# EAGLE design ASD2841 (EAGLE 6.3)
DATABASE: ./../../../../../Components/TinyCircuits_Part_Database.txt
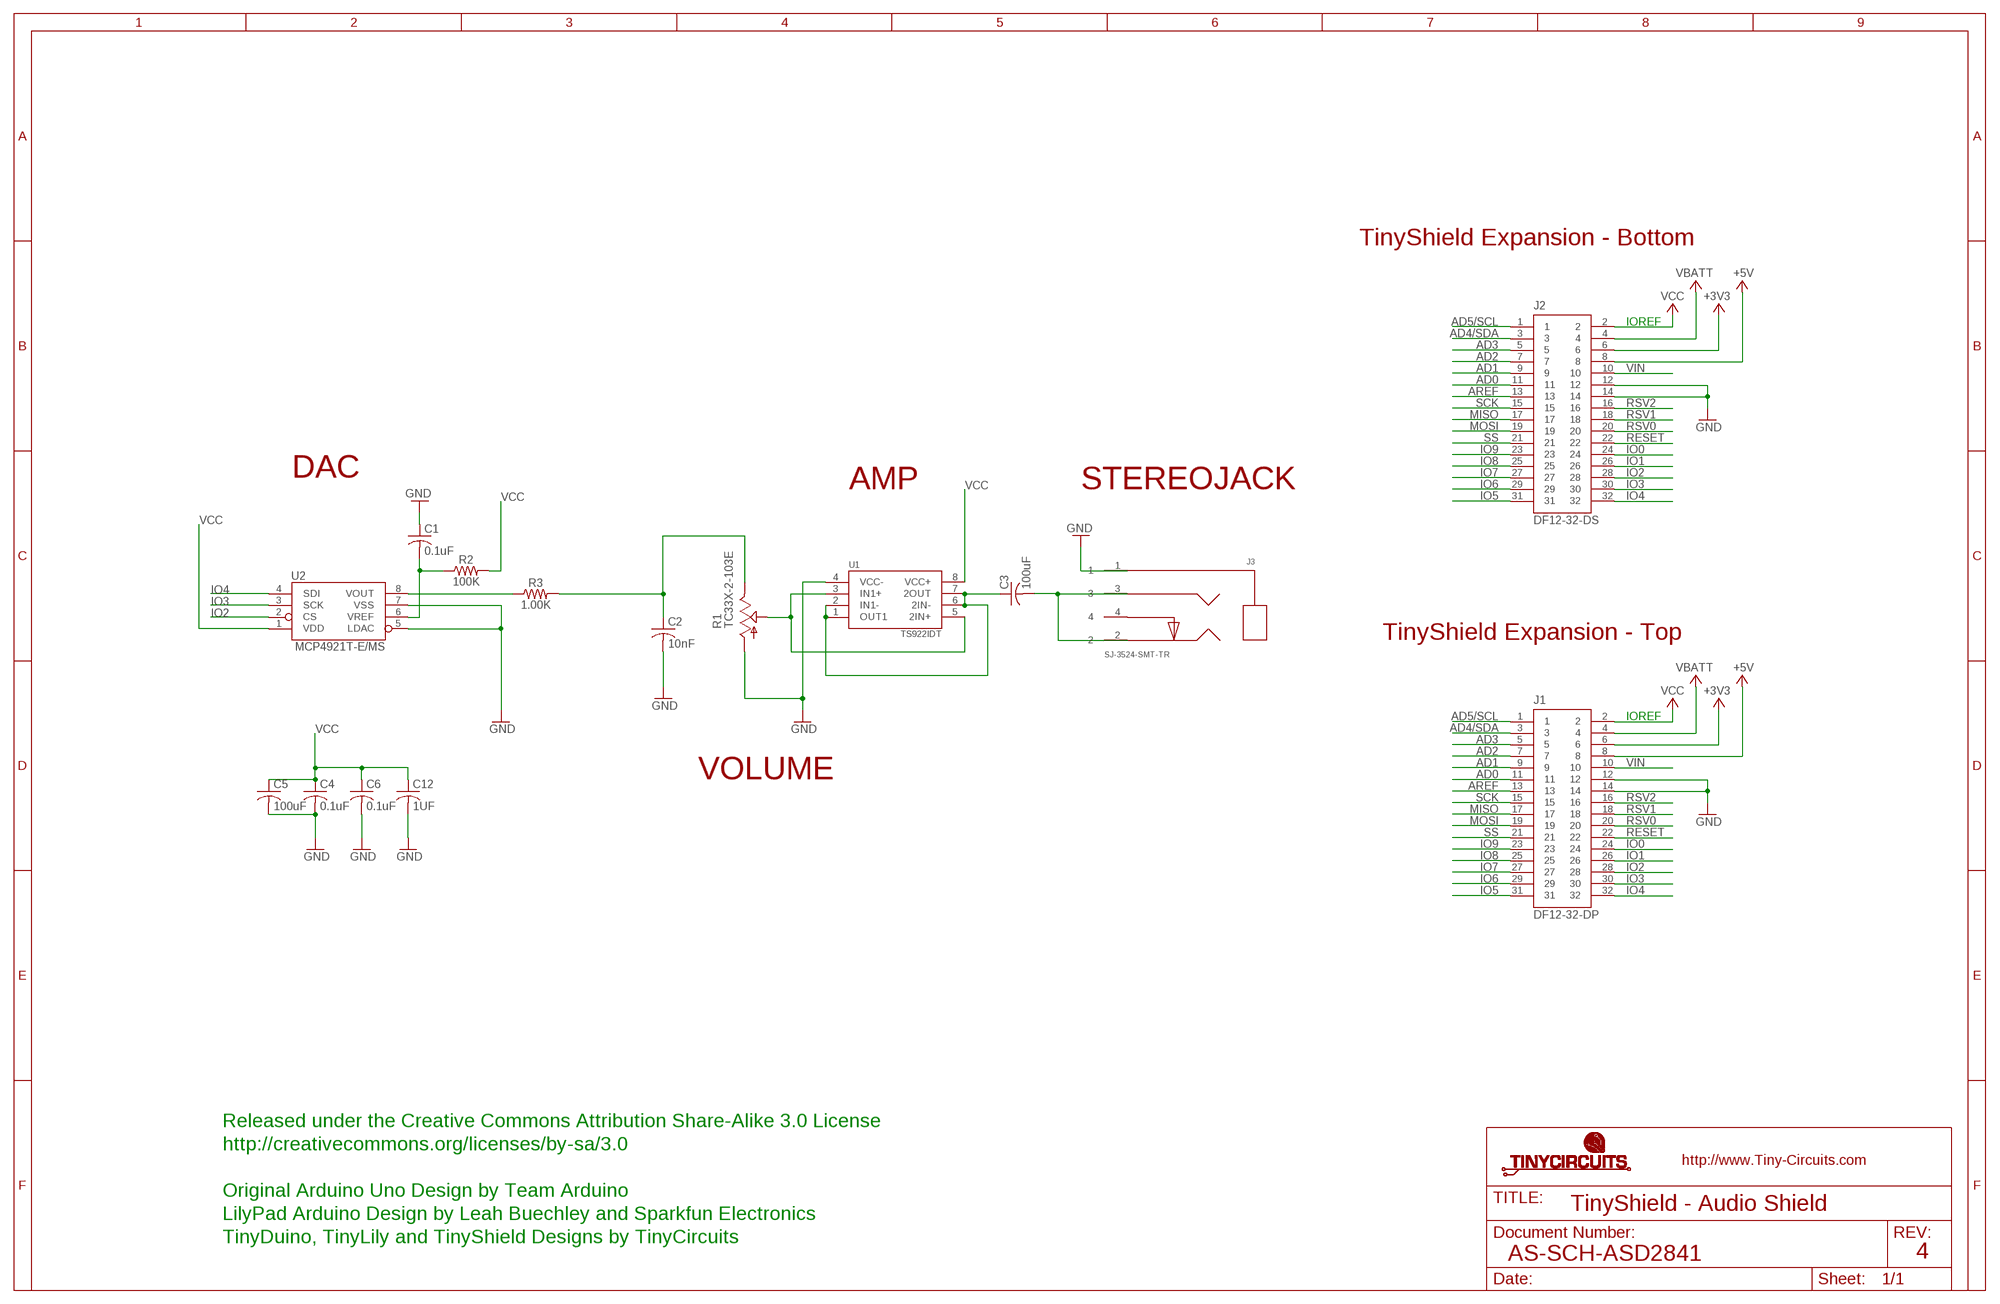
[diagram p0: schematic, sheet 1]

## Parts
C1  0.1uF  AS-ITM-00008  [C0402]
C2  10nF  AS-ITM-00084  [C0402]
C3  100uF  AS-ITM-00095  [C1206]
C4  0.1uF  AS-ITM-00008  [C0402]
C5  100uF  AS-ITM-00095  [C1206]
C6  0.1uF  AS-ITM-00008  [C0402]
C12  1UF  AS-ITM-00105  [C0402]
J1  DF12-32-DP  AS-ITM-00015  [DF12-32-DP]
J2  DF12-32-DS  AS-ITM-00012  [DF12-32-DS]
J3  SJ-3524-SMT-TR  AS-ITM-00094  [SJ-3524-SMT-TR]
R1  TC33X-2-103E  AS-ITM-00187  [TC33X-2-104E]
R2  100K  AS-ITM-00004  [0402]
R3  1.00K  AS-ITM-00003  [0402]
U1  TS922IDT  AS-ITM-00092  [SO-08]
U2  MCP4921T-E/MS  AS-ITM-00091  [MSOP8]

## Nets
+3V3: J1.6 J2.6
+5V: J1.8 J2.8
AD0: J1.11 J2.11
AD1: J1.9 J2.9
AD2: J1.7 J2.7
AD3: J1.5 J2.5
AD4/SDA: J1.3 J2.3
AD5/SCL: J1.1 J2.1
AREF: J1.13 J2.13
GND: C1.1 C2.2 C4.2 C5.2 C6.2 C12.2 J1.12 J1.14 J2.12 J2.14 J3.1 R1.1(A) U1.4(VCC-) U2.5(LDAC) U2.7(VSS)
IO0: J1.24 J2.24
IO1: J1.26 J2.26
IO2: J1.28 J2.28 U2.2(CS)
IO3: J1.30 J2.30 U2.3(SCK)
IO4: J1.32 J2.32 U2.4(SDI)
IO5: J1.31 J2.31
IO6: J1.29 J2.29
IO7: J1.27 J2.27
IO8: J1.25 J2.25
IO9: J1.23 J2.23
MISO: J1.17 J2.17
MOSI: J1.19 J2.19
N$1: R1.2(S) U1.3(IN1+) U1.5(2IN+)
N$2: C3.1 U1.1(OUT1) U1.2(IN1-) U1.6(2IN-) U1.7(2OUT)
N$3: C1.2 R2.1 U2.6(VREF)
N$4: R3.1 U2.8(VOUT)
N$9: C2.1 R1.3(E) R3.2
N$10: C3.2 J3.2 J3.3
RESET: J1.22 J2.22
RSV0: J1.20 J2.20
RSV1: J1.18 J2.18
RSV2: J1.16 J2.16
SCK: J1.15 J2.15
SS: J1.21 J2.21
VBATT: J1.4 J2.4
VCC: C4.1 C5.1 C6.1 C12.1 J1.2 J2.2 R2.2 U1.8(VCC+) U2.1(VDD)
VIN: J1.10 J2.10
Unconnected: J3.4

## Notes on the sheet
- TinyShield Expansion - Bottom
- IOREF
- DAC
- AMP | STEREOJACK
- TinyShield Expansion - Top
- IOREF
- VOLUME
- Released under the Creative Commons Attribution Share-Alike 3.0 License
- http://creativecommons.org/licenses/by-sa/3.0
- Original Arduino Uno Design by Team Arduino
- TinyShield - Audio Shield
- LilyPad Arduino Design by Leah Buechley and Sparkfun Electronics
- TinyDuino, TinyLily and TinyShield Designs by TinyCircuits
- AS-SCH-ASD2841 | 4

## Library data of the parts
C1 C4 C6 = tinycircuits:AS-ITM-00008: CAP CER 0.1UF 16V 10% X5R 0402; PARTNO: AS-ITM-00008
C2 = tinycircuits:AS-ITM-00084: CAP CER 10NF 25V 10% X7R 0402; PARTNO: AS-ITM-00084
C3 C5 = tinycircuits:AS-ITM-00095: CAP CER 100UF 10V 20% X5R 1206; PARTNO: AS-ITM-00095
C12 = tinycircuits:AS-ITM-00105: CAP CER 1UF 6.3V 10% X5R 0402; PARTNO: AS-ITM-00105; VALUE: 1uF
J1 = tinycircuits:AS-ITM-00015: CONN HEADER 32POS 3MM SMD 0.5MM; PARTNO: AS-ITM-00015
J2 = tinycircuits:AS-ITM-00012: CONN RECEPT 32POS 3MM SMD 0.5MM; PARTNO: AS-ITM-00012
J3 = tinycircuits:AS-ITM-00094: CONN AUDIO JACK 3.5MM STEREO SMD; PARTNO: AS-ITM-00094
R1 = tinycircuits:AS-ITM-00187: TRIMMER 10K OHM 0.1W SMD; PARTNO: AS-ITM-00187
R2 = tinycircuits:AS-ITM-00004: RES 100K OHM 1/16W 1% 0402; PARTNO: AS-ITM-00004
R3 = tinycircuits:AS-ITM-00003: RES 1.00K OHM 1/16W 1% 0402; PARTNO: AS-ITM-00003
U1 = tinycircuits:AS-ITM-00092: IC OPAMP GP 4MHZ RRO 8SO; PARTNO: AS-ITM-00092
U2 = tinycircuits:AS-ITM-00091: DAC 12BIT SGL W/SPI 8MSOP; PARTNO: AS-ITM-00091; VALUE: MCP4921-E/MS

## Board
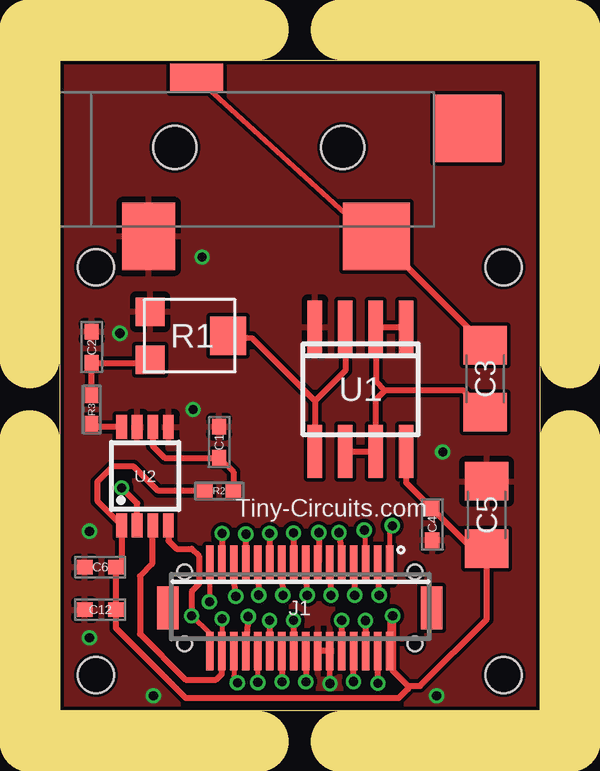
[diagram p1: board, top side]
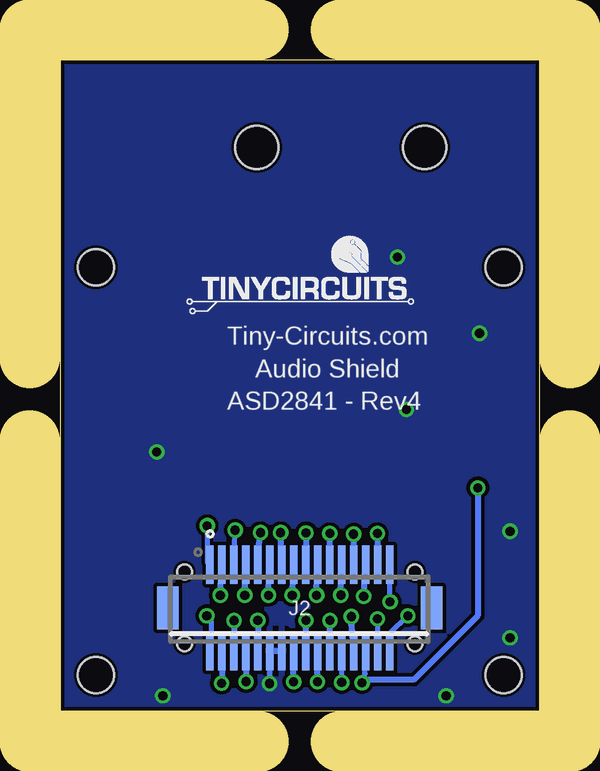
[diagram p2: board, bottom side, seen from below]

Size 20 x 27.14 mm. Coordinates in mm from the lower left corner, seen from the top.
Outline: 0,27.14 20,27.14 20,0 0,0 0,27.14
Copper layers (1*16): Top 0.035mm / dielectric 1.5mm / Bottom 0.035mm
Design rules "default *": minimum track width 8mil, minimum drill 15mil, track to track 6mil, track to pad 6mil, pad to pad 6mil, via to via 6mil, smd to smd 6mil, copper to edge 6mil, drill to drill 8mil, minimum pad ring 10mil, minimum via ring 5mil, stop-mask expansion 4mil, vias tented up to drill 25mil, thermal gap 10mil
Holes 1.5 mm at 1.5,18.5 18.5,18.5 18.5,1.5 1.5,1.5
Milling: 8 lines

### Footprints (pad centres in the part's own frame; a part is rotated, then mirrored left to right if it is on the bottom)
C0402 = smd 0.65 x 0.6: 1 -0.65,0; 2 0.65,0
C1206 = smd 1.6 x 1.8: 1 -1.4,0; 2 1.4,0
DF12-32-DP = smd 0.3 x 1.6: 1 -3.75,-1.8; 2 -3.75,1.8; 3 -3.25,-1.8; 4 -3.25,1.8; 5 -2.75,-1.8; 6 -2.75,1.8; 7 -2.25,-1.8; 8 -2.25,1.8; 9 -1.75,-1.8; 10 -1.75,1.8; 11 -1.25,-1.8; 12 -1.25,1.8; 13 -0.75,-1.8; 14 -0.75,1.8; 15 -0.25,-1.8; 16 -0.25,1.8; 17 0.25,-1.8; 18 0.25,1.8; 19 0.75,-1.8; 20 0.75,1.8; 21 1.25,-1.8; 22 1.25,1.8; 23 1.75,-1.8; 24 1.75,1.8; 25 2.25,-1.8; 26 2.25,1.8; 27 2.75,-1.8; 28 2.75,1.8; 29 3.25,-1.8; 30 3.25,1.8; 31 3.75,-1.8; 32 3.75,1.8 | smd 0.9 x 1.8: F1 -5.5,0; F2 5.5,0 | hole 0.6: -4.8,1.5; 4.8,1.5
DF12-32-DS = smd 0.3 x 1.6: 1 -3.75,1.8; 2 -3.75,-1.8; 3 -3.25,1.8; 4 -3.25,-1.8; 5 -2.75,1.8; 6 -2.75,-1.8; 7 -2.25,1.8; 8 -2.25,-1.8; 9 -1.75,1.8; 10 -1.75,-1.8; 11 -1.25,1.8; 12 -1.25,-1.8; 13 -0.75,1.8; 14 -0.75,-1.8; 15 -0.25,1.8; 16 -0.25,-1.8; 17 0.25,1.8; 18 0.25,-1.8; 19 0.75,1.8; 20 0.75,-1.8; 21 1.25,1.8; 22 1.25,-1.8; 23 1.75,1.8; 24 1.75,-1.8; 25 2.25,1.8; 26 2.25,-1.8; 27 2.75,1.8; 28 2.75,-1.8; 29 3.25,1.8; 30 3.25,-1.8; 31 3.75,1.8; 32 3.75,-1.8 | smd 0.9 x 1.8: F1 -5.5,0; F2 5.5,0 | hole 0.6: -4.8,1.5; 4.8,1.5
SJ-3524-SMT-TR = smd 2.2 x 2.8: 1 -4.1,-3.7 | smd 2.8 x 2.8: 2 5.4,-3.7; 4 9.2,0.8 | smd 2.2 x 1.2: 3 -2.1,2.9 | hole 1.8: -3,0; 4,0
TC33X-2-104E = smd 1.2 x 1.2: 1 -1,-1.75; 3 1,-1.75 | smd 1.6 x 1.5: 2 0,1.5
0402 = smd 0.65 x 0.55: 1 -0.6,0; 2 0.6,0
SO-08 = smd 0.6 x 2.2: 1 -1.905,-2.6; 2 -0.635,-2.6; 3 0.635,-2.6; 4 1.905,-2.6; 5 1.905,2.6; 6 0.635,2.6; 7 -0.635,2.6; 8 -1.905,2.6
MSOP8 = smd 0.45 x 1: 1 -0.975,-2.05; 2 -0.325,-2.05; 3 0.325,-2.05; 4 0.975,-2.05; 5 0.975,2.05; 6 0.325,2.05; 7 -0.325,2.05; 8 -0.975,2.05

### Placement (x,y rotation side)
C1  6.64,11.21 270 top
C2  1.32,15.17 90 top
C3  17.73,13.85 90 top
C4  15.53,7.78 270 top
C5  17.8,8.17 90 top
C6  1.68,6 180 top
C12  1.68,4.22 180 top
J1  10,4.3 180 top
J2  10,4.3 0 bottom
J3  7.8,23.49 0 top
R1  5.51,15.65 270 top
R2  6.64,9.18 180 top
R3  1.33,12.57 90 top
U1  12.54,13.42 180 top
U2  3.55,9.8 0 top
U$1  [DOCFIELD-TINYCIRCUITS-PCB]  33.91,-10 0 top  (outside the outline)

### Tracks (layer width: path | path; a pad name or v marks a point on that pad's centre or on a via)
+3V3  (via drill 0.38)
  Top 0.254: J2.6 v12.75,3.77 v12.74,3.77
  Bottom 0.254: v12.74,3.77 12.74,2.51 J2.6
+5V  (via drill 0.38)
  Top 0.254: v12.24,1.23 J2.8
  Bottom 0.254: J2.8 12.25,1.21 v12.24,1.23
AD0  (via drill 0.38)
  Top 0.254: v11.3,4.83 11.31,5.05 J2.11
  Bottom 0.254: J2.11 11.28,5.79 v11.3,4.83
AD1  (via drill 0.38)
  Top 0.254: J2.9 11.79,6.27 v11.64,7.44
  Bottom 0.254: v11.64,7.44 11.78,6.22 J2.9
AD2  (via drill 0.38)
  Top 0.254: v12.29,4.83 12.31,5.05 J2.7
  Bottom 0.254: J2.7 12.27,5.86 v12.29,4.83
AD3  (via drill 0.38)
  Top 0.203: v12.69,7.54 J2.5
  Bottom 0.203: 12.75,6.44 J2.5 v12.69,7.54
AD4/SDA  (via drill 0.38)
  Top 0.254: v13.31,4.83 13.31,5 J2.3
  Bottom 0.254: J2.3 13.28,5.86 v13.31,4.83
AD5/SCL  (via drill 0.38)
  Top 0.203: J2.1 13.75,7.61 v13.86,7.72
  Bottom 0.203: v13.86,7.72 13.86,6.21 J2.1
AREF  (via drill 0.38)
  Top 0.254: J2.13 10.8,6.27 v10.8,7.43
  Bottom 0.254: v10.8,7.43 10.77,6.59 J2.13
GND  (via drill 0.38)
  Top 0.203: v11.26,1.14 J2.12
  Top 0.254: J2.12 J2.14
  Bottom 0.203: J2.12 v11.26,1.14
  Bottom 0.254: J2.12 J2.14
  other vias: 15.71,0.63 3.9,0.63 1.23,7.49 15.96,10.79 5.93,18.92 5.55,12.57 2.5,15.75 1.23,3.05
  pour Top: 0.25,27.02 19.75,27.02 19.75,0.25 0.25,0.25
  pour Bottom: 0.25,27.02 19.75,27.02 19.75,0.25 0.25,0.25
IO0  (via drill 0.38)
  Top 0.203: J2.24 v8.25,1.19
  Bottom 0.203: v8.25,1.19 J2.24
IO1  (via drill 0.38)
  Top 0.254: v7.85,3.94 J2.26
  Bottom 0.254: 7.85,3.66 J2.26 v7.85,3.94
IO2  (via drill 0.38)
  Top 0.203: J2.28 7.25,1.45 v7.4,1.18
  Top 0.254: U2.2 3.22,8.65 v2.57,9.3
  Bottom 0.203: v7.4,1.18 7.27,1.56 7.27,2.48 J2.28
  Bottom 0.254: v2.57,9.3 2.57,3.97 5.24,1.3 7.14,1.3 v7.4,1.18
IO3  (via drill 0.38)
  Top 0.203: v6.76,3.84 6.76,2.51 J2.30 6.76,2.49
  Top 0.254: J2.30 6.75,1.54 6.51,1.3 5.24,1.3 3.34,3.21 3.34,5.62 3.84,6.13 3.84,7.72 U2.3
  Bottom 0.203: J2.30 v6.75,3.83 v6.76,3.84
IO4  (via drill 0.38)
  Top 0.203: J2.32 6.25,3.21 v5.49,3.97
  Top 0.254: U2.4 4.52,7.1 4.86,6.76 5.49,6.76 5.8,6.46 5.8,5.29 5.49,4.99 v5.49,3.97
  Bottom 0.203: v5.49,3.97 6.26,3.21 J2.32
IO5  (via drill 0.38)
  Top 0.203: J2.31 v6.23,4.55
  Bottom 0.203: v6.23,4.55 J2.31
IO6  (via drill 0.38)
  Top 0.254: J2.29 6.76,6.11 v6.76,7.4
  Bottom 0.254: J2.29 6.75,7.39 v6.76,7.4
IO7  (via drill 0.38)
  Top 0.254: v7.33,4.78 7.31,4.9 J2.27
  Bottom 0.254: J2.27 7.29,5.76 v7.33,4.78
IO8  (via drill 0.38)
  Top 0.254: J2.25 v7.75,7.37
  Bottom 0.254: v7.75,7.37 J2.25
IO9  (via drill 0.38)
  Top 0.254: v8.29,4.83 8.31,4.98 J2.23
  Bottom 0.254: J2.23 8.28,5.59 v8.29,4.83
MISO  (via drill 0.38)
  Top 0.254: J2.17 v9.75,7.41 v9.74,7.42
  Bottom 0.254: v9.74,7.42 9.74,6.11 J2.17
MOSI  (via drill 0.38)
  Top 0.254: v9.3,4.83 9.31,4.95 J2.19
  Bottom 0.254: J2.19 9.27,5.76 v9.3,4.83
N$1
  Top 0.254: U1.3 11.9,14.19 10.63,12.92 | 10.63,12.92 U1.5 | R1.2 8.01,15.54 10.63,12.92
N$2
  Top 0.254: U1.1 U1.2 13.17,13.75 13.55,13.37 | U1.6 U1.7 13.17,12.99 13.55,13.37 | C3.1 16.81,13.37 13.55,13.37
N$3
  Top 0.254: U2.6 3.87,11.05 4.37,10.56 C1.2 7.24,9.96 R2.1
N$4
  Top 0.254: U2.8 1.45,11.85 R3.1
N$9
  Top 0.254: R3.2 C2.1 3.61,14.52 R1.3
N$10
  Top 0.203: J3.2 13.1,19.63 J3.3
  Top 0.254: C3.2 J3.2
RESET  (via drill 0.38)
  Top 0.254: v8.74,3.77 J2.22
  Bottom 0.254: J2.22 8.75,3.69 v8.74,3.77
RSV0  (via drill 0.38)
  Top 0.254: J2.20 9.25,1.2 v9.26,1.22
  Bottom 0.254: v9.26,1.22 J2.20
RSV1  (via drill 0.38)
  Top 0.254: v9.74,3.77 9.74,2.51 J2.18
  Bottom 0.254: J2.18 9.75,3.72 v9.74,3.77
RSV2  (via drill 0.38)
  Top 0.254: J2.16 10.25,1.16 v10.25,1.22
  Bottom 0.254: v10.25,1.22 J2.16
SCK  (via drill 0.38)
  Top 0.254: v10.31,4.83 10.31,4.98 J2.15
  Bottom 0.254: J2.15 10.29,5.66 v10.31,4.83
SS  (via drill 0.38)
  Top 0.254: v8.75,7.4 J2.21
  Bottom 0.254: J2.21 v8.75,7.39 v8.75,7.4
VBATT  (via drill 0.38)
  Top 0.254: v13.26,1.16 J2.4
  Bottom 0.254: J2.4 13.25,1.24 v13.26,1.16
VCC  (via drill 0.38)
  Top 0.203: J2.2 13.75,3.84 v13.88,3.97
  Top 0.254: v13.88,3.97 13.88,1.68 14.51,1.05 | 14.51,1.05 15.02,1.05 17.8,3.82 C5.1 17.18,6.77 C4.1 14.44,9.52 U1.8 | 14.51,1.05 14.51,0.92 14.13,0.54 5.24,0.54 2.33,3.45 C12.1 C6.1 2.57,6.24 U2.1 1.56,8.76 1.56,9.56 2.19,10.19 3.08,10.19 4.1,9.18 R2.2
  Bottom 0.203: v13.88,3.97 13.82,3.97 13.7,3.84 13.7,2.55 J2.2
VIN  (via drill 0.38)
  Top 0.254: J2.10 v11.76,3.78 v11.75,3.78
  Bottom 0.254: v11.75,3.78 J2.10

### Text on the board
tPlace: Tiny-Circuits.com
bPlace: Tiny-Circuits.com | Audio Shield | ASD2841 - Rev4
Document: FABRICATION DRAWING | NOTES: | 1. PRINTED CIRCUIT BOARD MADE FROM NEMA GRADE FR-4 EPOXY LAMINATE | WITH 1 OUNCE COPPER PLATING AND .024 THICKNESS. | 2. ALL DIMENSIONS ARE GIVEN IN INCHES. | 3. CIRCUIT PATHS ARE FOR REFERENCE ONLY. | 4. HOLE SIZES SHOWN ARE FINISHED DIAMETERS AFTER PLATING. | 5. BOARD PLATED USING REFLOW OR SIMILAR METHOD. | 6. BOARD TO HAVE BLUE SOLDER MASK ON PLATED SURFACES USING WET FILM | 7. SILKSCREEN BOARD USING WHITE INK. | SR100 OR SR1010 EPOXY. EQUIVALENT WET OR DRY FILM MAY BE USED. | 8. THE FOLLOWING INFORMATION APPLIES TO THIS BOARD: | * 2 COPPER LAYERS | * .024 BOARD THICKNESS | * REQUIRES TOP SIDE SILKSCREEN | Released under the Creative Commons Attribution Share-Alike 3.0 License | http://creativecommons.org/licenses/by-sa/3.0 | Original Arduino Uno Design by Team Arduino | LilyPad Arduino Design by Leah Buechley and Sparkfun Electronics | TinyDuino, TinyLily and TinyShield Designs by TinyCircuits | TinyShield - Audio Shield | AS-PCB-ASD2841 | 4